# Altium schematic sheet Sheet1.SchDoc
size A4; SheetNumber: 1; SheetTotal: 2
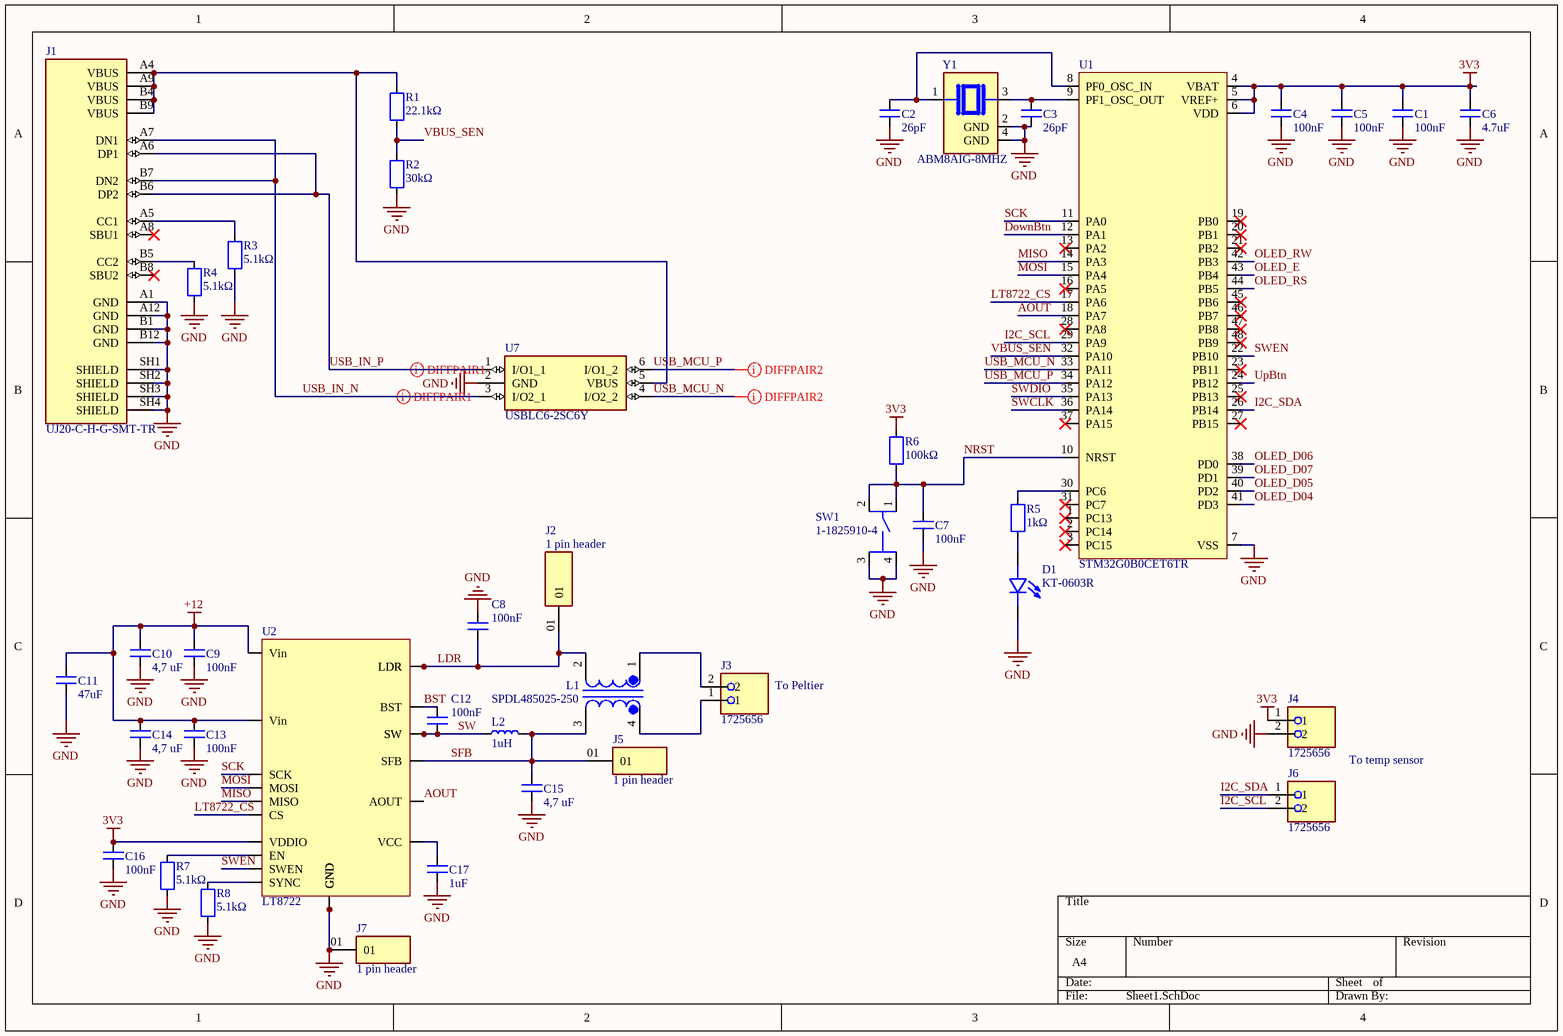
[diagram p0: Sheet1.SchDoc]

## Parts
C1  100nF  [0603 Imperial]
C2  26pF  [0603 Imperial]
C3  26pF  [0603 Imperial]
C4  100nF  [0603 Imperial]
C5  100nF  [0603 Imperial]
C6  4.7uF  [0603 Imperial]
C7  100nF  [0603 Imperial]
C8  100nF  [0603 Imperial]
C9  100nF  [0603 Imperial]
C10  4,7 uF  [CAPC3216X180X55LL20T25]
C11  47uF  [FP-TAJD-MFG]
C12  100nF  [0603 Imperial]
C13  100nF  [0603 Imperial]
C14  4,7 uF  [CAPC3216X180X55LL20T25]
C15  4,7 uF  [CAPC3216X180X55LL20T25]
C16  100nF  [0603 Imperial]
C17  1uF  [0603 Imperial]
D1  KT-0603R  [LED_KT-0603R]
J1  UJ20-C-H-G-SMT-TR  [CUI_UJ20-C-H-G-SMT-TR]
J2  1 pin header  [SAMTEC_MTMM-101-X-X-S-X]
J3  1725656  [PHOENIX_1725656]
J4  1725656  [PHOENIX_1725656]
J5  1 pin header  [SAMTEC_MTMM-101-X-X-S-X]
J6  1725656  [PHOENIX_1725656]
J7  1 pin header  [SAMTEC_MTMM-101-X-X-S-X]
L1  SPDL485025-250  [IND_SPDL485025-250-2P-T]
L2  1uH  [1uH Power Inductor]
R1  22.1kΩ  [0603 Imperial]
R2  30kΩ  [0603 Imperial]
R3  5.1kΩ  [0603 Imperial]
R4  5.1kΩ  [0603 Imperial]
R5  1kΩ  [0603 Imperial]
R6  100kΩ  [0603 Imperial]
R7  5.1kΩ  [0603 Imperial]
R8  5.1kΩ  [0603 Imperial]
SW1  1-1825910-4  [TE_1-1825910-4]
U1  STM32G0B0CET6TR  [STM32G0B0CET6TR]
U2  LT8722  [LT8722]
U7  USBLC6-2SC6Y  [USB ESD protection]
Y1  ABM8AIG-8MHZ  [XTAL_ABM8AIG-8.000MHZ-8-V1R-T]

## Nets
3V3: C1.1 C4.1 C5.1 C6.1 C16.1 J4.1 R6.2 U1.4(VBAT) U1.5(VREF+) U1.6(VDD) U2.14(VDDIO)
+12: C9.1 C10.1 C11.2 C13.1 C14.1 U2.4(Vin) U2.11(Vin)
GND: C1.2 C2.2 C3.2 C4.2 C5.2 C6.2 C7.2 C8.1 C9.2 C10.2 C11.1 C13.2 C14.2 C15.2 C16.2 C17.2 D1.C J1.A1(GND) J1.A12(GND) J1.B1(GND) J1.B12(GND) J1.SH1(SHIELD) J1.SH2(SHIELD) J1.SH3(SHIELD) J1.SH4(SHIELD) J4.2 J7.01 R2.1 R3.1 R4.1 R7.1 R8.1 SW1.3 SW1.4 U1.7(VSS) U2.5(GND) U2.10(GND) U2.21(GND) U2.22(GND) U7.2(GND) Y1.2(GND) Y1.4(GND)
AOUT: U1.18(PA7) U2.20(AOUT)
BST: C12.1 U2.3(BST)
DownBtn: U1.12(PA1)
I2C_SCL: J6.2 U1.29(PA9)
I2C_SDA: J6.1 U1.26(PB14)
LDR: C8.2 J2.01 L1.2 U2.8(LDR) U2.9(LDR)
LT8722_CS: U1.17(PA6) U2.15(CS)
MISO: U1.14(PA3) U2.18(MISO)
MOSI: U1.15(PA4) U2.17(MOSI)
NRST: C7.1 R6.1 SW1.1 SW1.2 U1.10(NRST)
OLED_D04: U1.41(PD3)
OLED_D05: U1.40(PD2)
OLED_D06: U1.38(PD0)
OLED_D07: U1.39(PD1)
OLED_E: U1.43(PB4)
OLED_RS: U1.44(PB5)
OLED_RW: U1.42(PB3)
SCK: U1.11(PA0) U2.16(SCK)
SFB: C15.1 J5.01 L1.3 L2.2 U2.12(SFB)
SW: C12.2 L2.1 U2.6(SW) U2.7(SW)
SWCLK: U1.36(PA14)
SWDIO: U1.35(PA13)
SWEN: U1.22(PB10) U2.13(SWEN)
UpBtn: U1.24(PB12)
USB_IN_N: J1.A7(DN1) J1.B7(DN2) U7.3(I/O2_1)
USB_IN_P: J1.A6(DP1) J1.B6(DP2) U7.1(I/O1_1)
USB_MCU_N: U1.33(PA11) U7.4(I/O2_2)
USB_MCU_P: U1.34(PA12) U7.6(I/O1_2)
VBUS_SEN: R1.1 R2.2 U1.32(PA10)
NetC2_1: C2.1 U1.8(PF0_OSC_IN) Y1.1
NetC3_1: C3.1 U1.9(PF1_OSC_OUT) Y1.3
NetC17_1: C17.1 U2.2(VCC)
NetD1_A: D1.A R5.1
NetJ1_A4: J1.A4(VBUS) J1.A9(VBUS) J1.B4(VBUS) J1.B9(VBUS) R1.2 U7.5(VBUS)
NetJ1_A5: J1.A5(CC1) R3.2
NetJ1_B5: J1.B5(CC2) R4.2
NetJ3_1: J3.1 L1.4
NetJ3_2: J3.2 L1.1
NetR5_2: R5.2 U1.30(PC6)
NetR7_2: R7.2 U2.19(EN)
NetR8_2: R8.2 U2.1(SYNC)

Not connected (* = marked no-connect by the designer): J1 A8(SBU1)* B8(SBU2)*; U1 1(PC13)* 2(PC14)* 3(PC15)* 13(PA2)* 16(PA5)* 19(PB0)* 20(PB1)* 21(PB2)* 23(PB11)* 25(PB13)* 27(PB15)* 28(PA8)* 31(PC7)* 37(PA15)* 45(PB6)* 46(PB7)* 47(PB8)* 48(PB9)*

## Layout directives
differential pair: USB_IN_N, USB_IN_P, USB_MCU_N, USB_MCU_P

## Notes on the sheet
- (near J3) To Peltier
- To temp sensor
- Labels drawn without touching a wire or pin: \

## Library data of the parts
C1-C9 C12 C13 C16 C17 = 0603 C
C10 C14 C15 = 1206 Cap
C11 = Large Cap
D1 = KT-0603R: Red 0603 Light Emitting Diodes; MF: Hubei KENTO Elec; SnapEDA_Link: https://www.snapeda.com/parts/KT-0603R/Hubei+KENTO+Elec/view-part/?ref=snap; Package: Package; Value: *; MP: KT-0603R; Check_prices: https://www.snapeda.com/parts/KT-0603R/Hubei+KENTO+Elec/view-part/?ref=eda
J1 = UJ20-C-H-G-SMT-TR: Type C, USB 2.0, 480 Mbps, 20 Vdc, 5 A, Right Angle, Gold Flash, Surface Mount, Black Insulator, USB Receptacle; MF: Same Sky; SnapEDA_Link: https://www.snapeda.com/parts/UJ20-C-H-G-SMT-TR/Same+Sky/view-part/?ref=snap; Package: None; Value: *; MP: UJ20-C-H-G-SMT-TR; Check_prices: https://www.snapeda.com/parts/UJ20-C-H-G-SMT-TR/Same+Sky/view-part/?ref=eda
J2 J5 J7 = 1 pin header: Connector Header Through Hole 1 position; MF: Samtec; MP: MTMM-101-05-G-S-225; SnapEDA_Link: https://www.snapeda.com/parts/MTMM-101-05-G-S-225/Samtec/view-part/?ref=snap; Package: None; Value: *; Check_prices: https://www.snapeda.com/parts/MTMM-101-05-G-S-225/Samtec/view-part/?ref=eda
J3 J4 J6 = 1725656: PCB Terminal Screw 2.54mm 20AWG 160V 6A 2 Position COMBICON MPT Series | Phoenix Contact 1725656; SnapEDA_Link: https://www.snapeda.com/parts/1725656/Phoenix+Contact/view-part/?ref=snap; Package: None; Value: *; MF: Phoenix Contact; MP: 1725656; Check_prices: https://www.snapeda.com/parts/1725656/Phoenix+Contact/view-part/?ref=eda
L1 = SPDL485025-250-2P-T: Availability: Unavailable; Price: None; Value: *; MP: SPDL485025-250-2P-T; Package: None
L2 = 1uH Power Inductor
R1-R8 = 0603 R
SW1 = 1-1825910-4: Switch Tactile OFF _ON_ SPST Round Button PC Pins 0.05A 24VDC 100000Cycles 1.56N Thru-Hole; MF: TE Connectivity; Availability: Unavailable; SnapEDA_Link: https://www.snapeda.com/parts/1-1825910-4/TE%20Connectivity%20ALCOSWITCH%20Switches/view-part/558688/?ref=snap; Price: None; EU_RoHS_Compliance: Compliant; Package: None; TE_purchase_URL: https://www.te.com/usa-en/product-1-1825910-4.html?te_bu=Cor&te_type=disp&te_campaign=seda_glo_cor-seda-global-disp-prtnr-fy19-seda-model-bom-cta_sma-317_1&elqCampaignId=32493; MP: 1-1825910-4; Value: *
U7 = USB ESD protection: 17V Clamp 5A (8/20µs) Ipp Tvs Diode Surface Mount SOT-23-6; MF: STMicroelectronics; SnapEDA_Link: https://www.snapeda.com/parts/USBLC6-2SC6Y/STMicroelectronics/view-part/?ref=snap; Package: SOT-23-6 STMicroelectronics; Value: *; MP: USBLC6-2SC6Y; Check_prices: https://www.snapeda.com/parts/USBLC6-2SC6Y/STMicroelectronics/view-part/?ref=eda
Y1 = ABM8AIG-8.000MHZ-8-V1R-T: 8 MHz Â±10ppm Crystal 8pF 500 Ohms 4-SMD, No Lead; MF: Abracon LLC; Check_prices: https://www.snapeda.com/parts/ABM8AIG-8.000MHZ-8-V1R-T/Abracon+LLC/view-part/?ref=eda; Price: None; SnapEDA_Link: https://www.snapeda.com/parts/ABM8AIG-8.000MHZ-8-V1R-T/Abracon+LLC/view-part/?ref=snap; MP: ABM8AIG-8.000MHZ-8-V1R-T; Value: *; Availability: In Stock; Package: SMD-4 Abracon LLC; Purchase-URL: https://pricing.snapeda.com/search/part/ABM8AIG-8.000MHZ-8-V1R-T/?ref=eda